# Altium schematic sheet CompensationRegression.SchDoc (part 2 of 2)
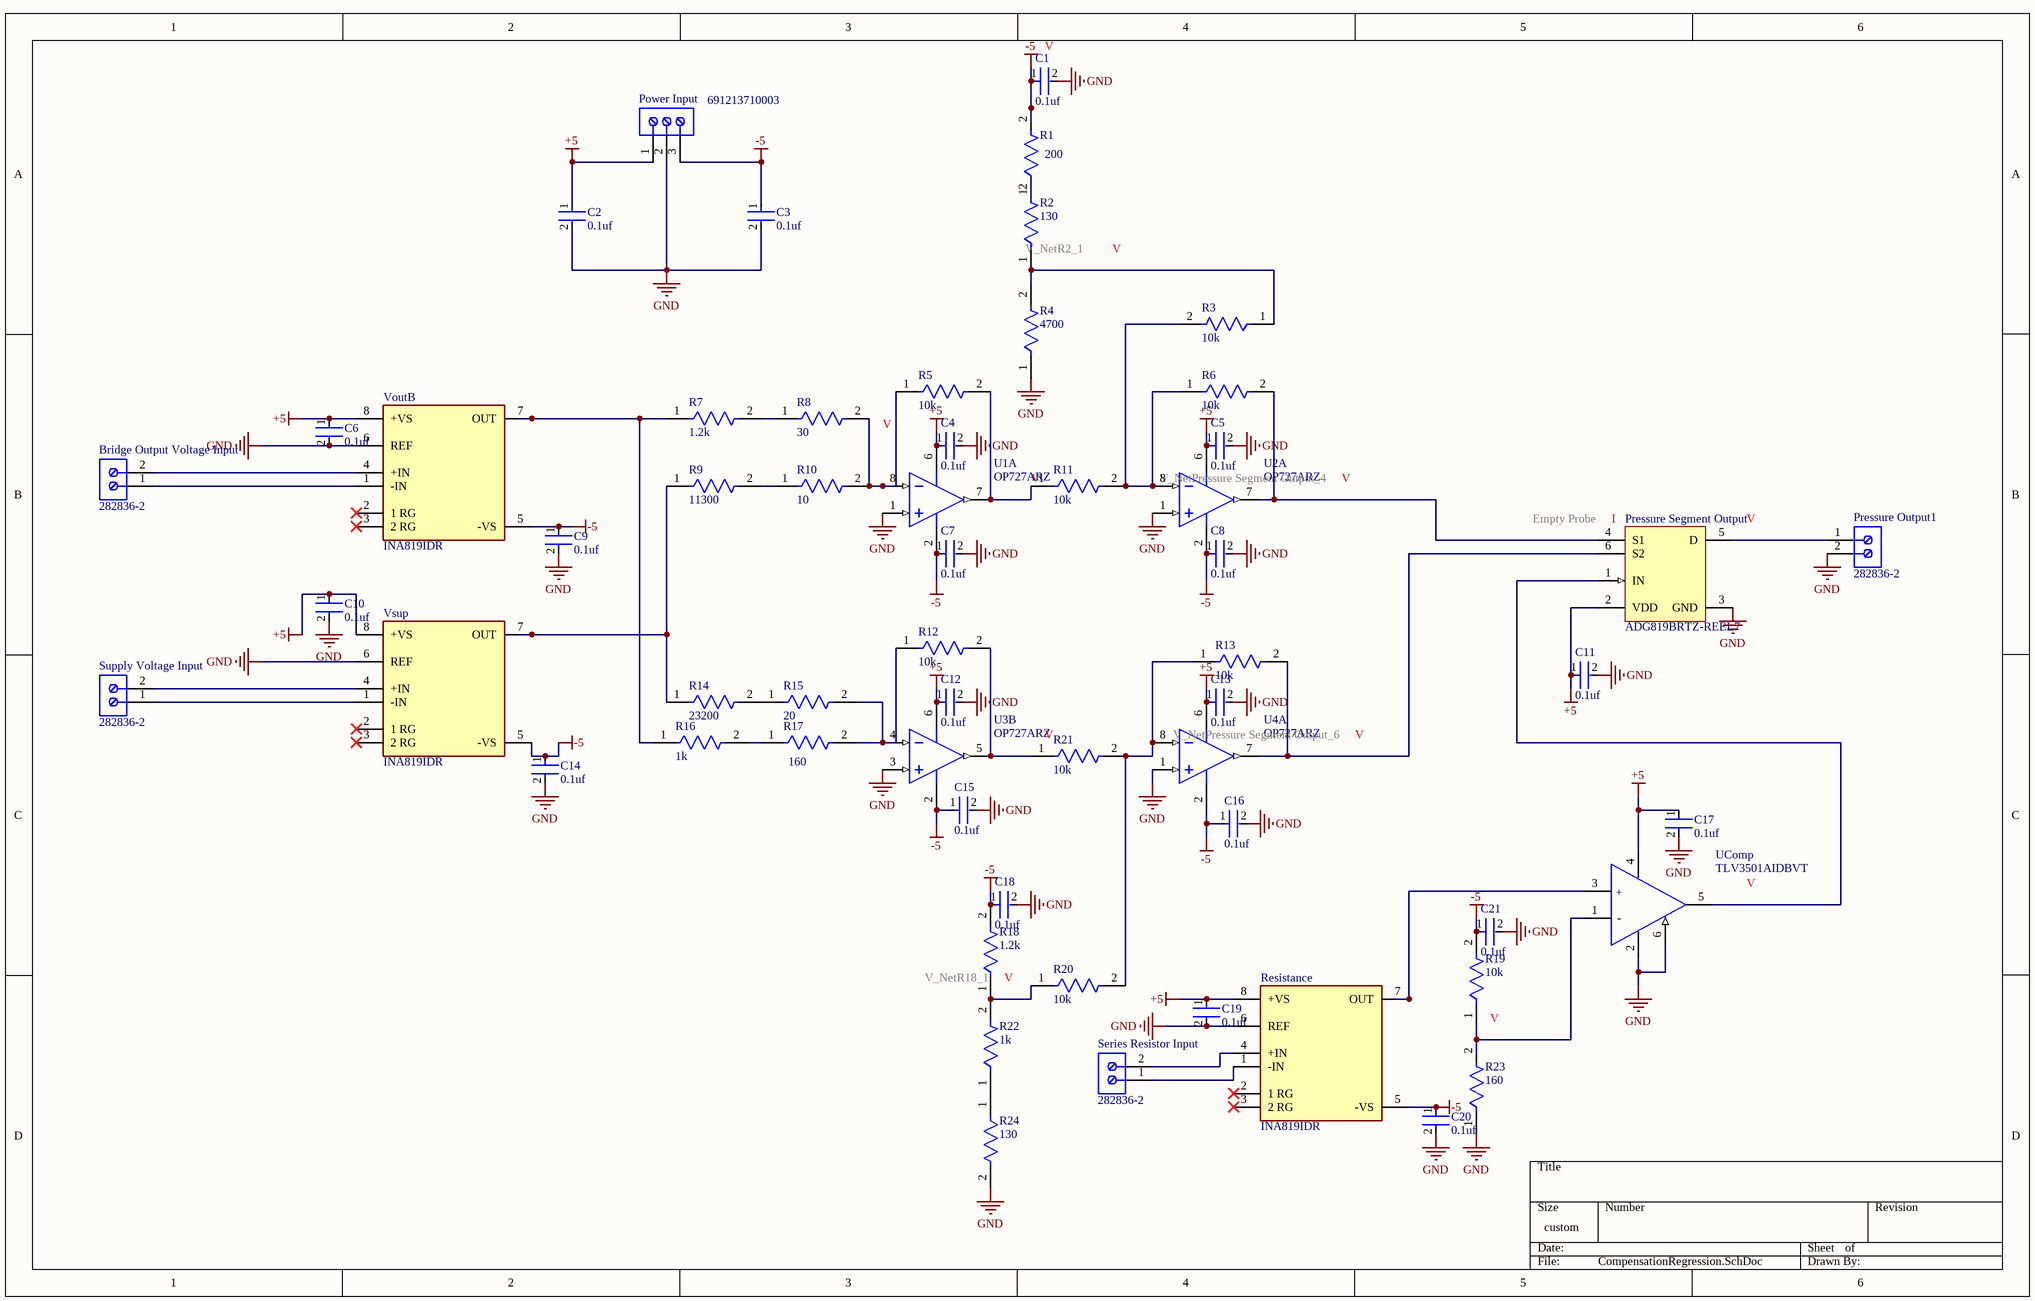
[diagram p1: CompensationRegression.SchDoc]

## Notes on the sheet
- (in symbol CMP-04896-000031-1) +; -

## Library data of the parts
Bridge_Output_Voltage_Input Pressure_Output1 Series_Resistor_Input Supply_Voltage_Input = CMP-1684-00017-1: Female Header, Pitch 5 mm, 1 x 2 Position, Height 10 mm, Tail Length 3.5 mm, Rohs, Bulk; Manufacturer: TE Connectivity; Wire Gauge: 16-30AWG; Product Training Modules: Wire-to-BoardEurostyleTerminalBlocks; Clamp Material - Plating: Brass-NickelPlated; Voltage: 300V; Mating Orientation: HorizontalwithBoard; Current: 13.5A; Pitch: 0.197"(5.00mm); Screw Thread: M3; 3D Model: 282836-2.pdf; Other Names: 5ULV-02B / A98076; Dynamic Catalog: BuchananSeries; Number of Levels: 1; Torque - Screw: 0.68Nm(6Lb-In); Featured Product: EurostyleTerminalBlockConnectors; Positions Per Level: 2; Wire Termination: Screw-RisingCageClamp; Datasheet URL: http://www.te.com.cn/commerce/DocumentDelivery/DDEController?Action=showdoc&DocId=Catalog+Section%7F1308389_EUROSTYLE_TERMINAL_BLOCKS%7F0607%7Fpdf%7FEnglish%7FENG_CS_1308389_EUROSTYLE_TERMINAL_BLOCKS_0607.pdf%7F282836-2; Color: Green; Family: TerminalBlocks-WiretoBoard; RoHS Information: 282836-2StatementofCompliance; Standard Package: 300; Contact Material - Plating: Brass-TinPlated; Manufacturer URL: http://www.te.com; Housing Material: Polyamide(PA66),Nylon6/6; Features: Interlocking(Side); Package Description: Female Header, Pitch 5 mm, 1 x 2 Position, Height 10 mm, Tail Length 3.5 mm; Mounting Type: ThroughHole; Package Reference: THD; Packaging: Bulk; Series: Buchanan; Category: Connectors,Interconnects; Screw Material - Plating: Brass-NickelPlated
C1-C21 = CMP-2006-03061-2: CAP CER 0.1UF 50V X7R 0603; Manufacturer: KEMET; Manufacturer Part Number: C0603C104K5RACTU; Tolerance: 0.1; Temperature Coefficient: 30ppm/°C; Material: Ceramic; Automotive Grade: Grade 1; Value: 0.10 μF; Temperature: -55°C to +125°C; RoHS: TRUE; Temperature Range High: +125°C; Lead Free: Yes; Octopart: https://octopart.com/c0603c104k5ractu-kemet-139244; Digikey Description: CAP CER 0.1UF 50V X7R 0603; Category: Cap; Package: C0603C-CF; ComponentLink2Description: Datasheet; Temperature Range Low: -55°C; Device Class L1: Passive Components; Voltage Rating: 50 V; Automotive: Yes; Device Class L3: Ceramic Capacitors; ComponentLink2URL: https://api.kemet.com/component-edge/download/datasheet/C0603C100J5GACAUTO.pdf; Capacitance: 0.10 μF; Device Class L2: Capacitors; Temperature Characteristic: X7R; Height: 0.87mm
Power_Input = CMP-1502-02527-2: NexarPartId: 8917719; Number of Contacts: 3; Wire/Cable Gauge: 16AWG; Wire Gauge (Max): 26AWG; Connector Type: PCB, Terminal Block; Number of Levels: 1; Plating: Brass, Steel; Current: 10A; Voltage: 300V; Stripping Length: -7mm; Pitch: 5.0038mm; REACH SVHC: Unknown; Mount: Through Hole; Max Operating Temperature: 105°C; Contact Plating: Tin; Termination: Screw; Contact Material: Brass; Housing Material: Nylon; Color: Green; RoHS: Compliant; Wire Gauge (Min): 16AWG; Min Operating Temperature: -40°C; Length: 8.3mm; Packaging: Box; Number of Pins: 3; Lead Pitch: 5mm; Number of Positions Per Level: 3; Height: 10mm; Width: 15.6mm
Pressure_Segment_Output = CMP-0790-00095-1: 0.5 Ohm, CMOS, 1.8 to 5.5 V, 2:1 Mux / SPDT Switch, -40 to 125 degC, 6-pin SOT23 (RJ-6), Reel; Manufacturer: Analog Devices; Ron (ohms): 0.5; Min Pos Supply: 1.8V; Id, Is (ON): 10pA, 10pA; Power Dissipation: 5uW; # Sw Functions: 1; Max Pos Supply: 5.5V; PackageDescription: 6-Pin Small Outline Transistor Package, Body 2.9 x 1.6 mm, Pitch 0.95 mm; PackageReference: RJ-6; PackageVersion: 121608-A, 12/2008; ComponentLink2Description: Datasheet; DatasheetVersion: 02-03-2012-A; Code_JEDEC: MO-178-AB; ComponentLink1Description: Manufacturer URL; ComponentLink3Description: Package Specification; Configuration: SPDT; ComponentLink2URL: http://www.analog.com/static/imported-files/data_sheets/ADG819.pdf; Is OFF: 10pA, 10pA; Mounting Technology: Surface Mount; Packing: Reel; PartNumber: ADG819BRTZ-REEL7; ComponentLink3URL: http://www.analog.com/static/imported-files/packages/PKG_PDF/SOT-23(RJ)/RJ_6.pdf; ComponentLink1URL: http://www.analog.com/en/index.html
R1 = CMP-2000-03062-2: RES Thick Film, 200Ω, 1%, 0.1W, 100ppm/°C, 0603; Power Rating: 100mW; Voltage Rating (DC): 75V; Resistance: 200R; Value: 200R; Military Standard: Not; Tolerance: 1%; Lead Free: Lead Free; Case Code (Imperial): 0603; Depth: 0.85mm; Max Operating Temperature: 155°C; Contact Plating: Tin; Length: 1.55mm; Weight: 7.1E-05oz; Voltage Rating: 75V; Height: 0.45mm; Min Operating Temperature: -55°C; Case/Package: 0603; Number of Pins: 2; Composition: Thick Film; Termination: SMD/SMT; Case Code (Metric): 1608; Width: 0.85mm; Package Quantity: 5000; Temperature Coefficient: 100ppm/°C; Packaging: Tape and Reel
R2 R24 = CMP-2000-03889-2: RES Thick Film, 130Ω, 1%, 0.1W, 100ppm/°C, 0603; Working Voltage: 75V; Power Rating: 100mW; Resistance: 130R; Value: 130R; Depth: 0.85mm; Max Operating Temperature: 155°C; Width: 0.85mm; Composition: Thick Film; Radiation Hardening: No; Contact Plating: Tin; Tolerance: 1%; Number of Pins: 2; Length: 1.55mm; Case/Package: 0603; Features: Automotive AEC-Q200; Case Code (Metric): 1608; Min Operating Temperature: -55°C; Package Quantity: 10; Temperature Coefficient: 100ppm/°C; Packaging: Tape and Reel; Lead Free: Lead Free; Number of Terminations: 2; Voltage Rating (DC): 75V; Termination: SMD/SMT; Height: 0.45mm; Military Standard: Not; Max Power Dissipation: 100mW; Voltage Rating: 75V; Weight: 7.1E-05oz; Case Code (Imperial): 0603
R3 R5 R6 R11-R13 R19-R21 = CMP-03412-005349-1: RES SMD 10K OHM 1% 1/10W 0603; Manufacturer: Yageo; Manufacturer Part Number: RT0603FRE0710KL; Value: 10KΩ; Temperature Coefficient: 50 ppm/°C; Power Rating: 0.1W; Tolerance: 0.01; Voltage Rating: 75V; RoHS: TRUE; Category: Res; Automotive: No; Digikey Description: RES SMD 10K OHM 1% 1/10W 0603; ComponentLink2Description: Datasheet; Octopart: https://octopart.com/rt0603fre0710kl-yageo-40009243; ComponentLink2URL: http://www.yageo.com/documents/recent/PYu-RT_1-to-0.01_RoHS_L_9.pdf; Device Class L3: Chip SMD Resistors; Device Class L1: Passive Components; Temperature Range High: +155°C; Height: 0.55mm; Composition: Thin Film; Ipc Land Pattern Name: RESC16080X45; Series: RT; Package: RT0603; Resistance: 10KΩ; Footprint Url: http://www.yageo.com/exep/pages/download/literatures/PYu-R_Mount_10.pdf; Temperature: -55°C to +155°C; Temperature Range Low: -55°C; Lead Free: Yes; Device Class L2: Resistors; Mouser Description: Thin Film Resistors - SMD 10K ohm 1% 1/10W
R4 = CMP-02407-006571-1: RES SMD 100 OHM 1% 1/8W 0603; Tolerance: 0.1%; Temperature Coefficient: 25ppm/°C; Power Rating: 100mW; Resistance: 4.7kR; Max Operating Temperature: 125°C; Lead Free: Lead Free; Contact Plating: Tin; Depth: 0.85mm; Case/Package: 0603; Packaging: Tape and Reel; Min Operating Temperature: -55°C; Composition: Thin Film; Military Standard: Not; Mount: Surface Mount; Width: 850um; Radiation Hardening: No; Length: 1.55mm; Height: 0.45mm
R7 = CMP-28537-003800-1: Automotive Metal Thin Film Chip Resistor, 0402, 1.2kΩ, 0.05%, 25ppm/°C, 0.0625W, 75V / Actually TNPW04021K20BYEP; Voltage Rating: 25V; Power Rating: 30mW; Resistance: 1.2kR; Max Power Dissipation: 63mW; Value: 1.2kR; Case Code (Imperial): 0402; Termination: SMD/SMT; Lead Free: Lead Free; Packaging: Tape and Reel; Case Code (Metric): 1005; Series: RG; Min Operating Temperature: -55°C; Temperature Coefficient: 25ppm/°C; Length: 1mm; Tolerance: 0.05%; Width: 0.5mm; RoHS Compliant: Yes; Number of Terminations: 2; Voltage Rating (DC): 25V; Resistor Type: Thin Film; Package Quantity: 5000; Case/Package: 0402; Height: 0.35mm; Features: Automotive AEC-Q200; Max Operating Temperature: 155°C
R8 = CMP-2001-03810-2: RES SMD 30 OHM 1% 1/8W 0805; Manufacturer Part Number: CRCW080530R0FKEA; Manufacturer: Vishay; Temperature Coefficient: 100ppm/°C; Voltage Rating: 150V; Automotive Grade: Grade 0; Resistance: 30Ω; Power Rating: 0.125W; Value: 30Ω; Category: Res; Octopart: https://octopart.com/crcw080530r0fkea-vishay-39861726; Height: 0.5mm; Automotive: Yes; Mouser Description: Thick Film Resistors - SMD 1/8watt 30ohms 1%; Series: CRCW; Temperature Range Low: -55°C; Device Class L1: Passive Components; Device Class L2: Resistors; Lead Free: Yes; Package: CRCW0805-e3; Tolerance: 1%; Ipc Land Pattern Name: RESC200125X45; Temperature: -55°C to +155°C; RoHS: TRUE; Temperature Range High: +155°C; Device Class L3: Chip SMD Resistors; ComponentLink2Description: Datasheet; Composition: Thick Film; ComponentLink2URL: https://www.vishay.com/docs/20035/dcrcwe3.pdf; Digikey Description: RES SMD 30 OHM 1% 1/8W 0805
R9 = CMP-03211-001549-1: RP73P 0402 11.3Ω 0.1W 25ppm/°C 0.10% 50V; Manufacturer: TE Connectivity; Manufacturer Part Number: RP73PF1E11R3BTDF; Temperature: -55°C to +155°C; Package: RP73P-1E; Power Rating: 0.1W; Ipc Land Pattern Name: RESC10050X30; Resistance: 11.3Ω; Device Class L2: Resistors; RoHS: TRUE; Value: 11.3Ω; Device Class L1: Passive Components; Temperature Range Low: -55°C; Category: Res; ComponentLink2URL: https://www.te.com/commerce/DocumentDelivery/DDEController?Action=srchrtrv&DocNm=1773272&DocType=DS&DocLang=English; Device Class L3: Chip SMD Resistors; Series: RP73P; ComponentLink2Description: Datasheet; Octopart: https://octopart.com/rp73pf1e11r3btdf-te+connectivity-89154032; Temperature Range High: +155°C; Automotive: No; Composition: Thin Film; Temperature Coefficient: 25ppm/°C; Tolerance: 0.10%; Lead Free: Yes; Voltage Rating: 50V; Height: 0.35mm
R10 = CMP-2000-03845-2: RES Thick Film, 10Ω, 1%, 0.1W, 100ppm/°C, 0603; Resistance: 10R; Voltage Rating (DC): 75V; Power Rating: 100mW; Value: 10R; Depth: 0.85mm; Height: 0.45mm; Package Quantity: 10; Temperature Coefficient: 100ppm/°C; Weight: 7.1E-05oz; Case Code (Metric): 1608; Number of Terminations: 2; Features: Automotive AEC-Q200; Termination: SMD/SMT; Lead Free: Lead Free; Mount: Surface Mount; Number of Pins: 2; Tolerance: 1%; Max Power Dissipation: 100mW; Width: 0.033inch; Contact Plating: Tin; Case Code (Imperial): 0603; Max Operating Temperature: 155°C; Min Operating Temperature: -55°C; Voltage Rating: 75V; Length: 1.55mm; Case/Package: 0603; Composition: Thick Film; Packaging: Tape and Reel; Military Standard: Not
R14 = CMP-2000-03845-2: RES Thick Film, 10Ω, 1%, 0.1W, 100ppm/°C, 0603 / Should be RMCF0603FT23K2; Resistance: 10R; Voltage Rating (DC): 75V; Power Rating: 100mW; Value: 10R; Depth: 0.85mm; Height: 0.45mm; Package Quantity: 10; Temperature Coefficient: 100ppm/°C; Weight: 7.1E-05oz; Case Code (Metric): 1608; Number of Terminations: 2; Features: Automotive AEC-Q200; Termination: SMD/SMT; Lead Free: Lead Free; Mount: Surface Mount; Number of Pins: 2; Tolerance: 1%; Max Power Dissipation: 100mW; Width: 0.033inch; Contact Plating: Tin; Case Code (Imperial): 0603; Max Operating Temperature: 155°C; Min Operating Temperature: -55°C; Voltage Rating: 75V; Length: 1.55mm; Case/Package: 0603; Composition: Thick Film; Packaging: Tape and Reel; Military Standard: Not
R15 = CMP-2002-08359-2: RES Thick Film, 20Ω, 1%, 0.063W, 100ppm/°C, 0402; Resistance: 20R; Voltage Rating: 50V; Max Power Dissipation: 63mW; Value: 20R; Mount: Surface Mount; Packaging: Tape and Reel; Military Standard: Not; Height: 0.35mm; Depth: 0.5mm; Lead Free: Lead Free; Number of Terminations: 2; Contact Plating: Tin; Max Operating Temperature: 155°C; Package Quantity: 10; Termination: SMD/SMT; Min Operating Temperature: -55°C; Features: Automotive AEC-Q200; Radiation Hardening: No; Case Code (Metric): 1005; Width: 0.02inch; Composition: Thick Film; Case/Package: 0402; Case Code (Imperial): 0402; Temperature Coefficient: 100ppm/°C; Tolerance: 1%; Power Rating: 63mW; Voltage Rating (DC): 50V; Length: 1mm; Weight: 2.3E-05oz
R16 R22 = CMP-2002-08276-2: RES Thick Film, 1kΩ, 1%, 0.063W, 100ppm/°C, 0402; Resistance: 1kR; Power Rating: 63mW; Voltage Rating (DC): 50V; Value: 1kR; Package Quantity: 10; Termination: SMD/SMT; Width: 0.5mm; Military Standard: Not; Length: 1mm; Contact Plating: Tin; Mount: Surface Mount; Packaging: Tape and Reel; Case Code (Imperial): 0402; Tolerance: 1%; Weight: 2.3E-05oz; Number of Pins: 2; Case/Package: 0402; Case Code (Metric): 1005; Lead Free: Lead Free; Number of Terminations: 2; Max Power Dissipation: 63mW; Depth: 0.5mm; Temperature Coefficient: 100ppm/°C; Max Operating Temperature: 155°C; Height: 0.35mm; Features: Automotive AEC-Q200; Composition: Thick Film; Radiation Hardening: No; Voltage Rating: 50V; Min Operating Temperature: -55°C
R17 R23 = CMP-2002-08228-2: RES Thick Film, 160Ω, 1%, 0.063W, 100ppm/°C, 0402; Power Rating: 63mW; Voltage Rating: 50V; Resistance: 160R; Value: 160R; Min Operating Temperature: -55°C; Composition: Thick Film; Depth: 0.5mm; Temperature Coefficient: 100ppm/°C; Military Standard: Not; Case/Package: 0402; Radiation Hardening: No; Max Operating Temperature: 155°C; Case Code (Metric): 1005; Number of Terminations: 2; Weight: 2.3E-05oz; Tolerance: 1%; Features: Automotive AEC-Q200; Width: 0.02inch; Number of Pins: 2; Length: 1mm; Max Power Dissipation: 63mW; Case Code (Imperial): 0402; Height: 0.016inch; Termination: SMD/SMT; Package Quantity: 10; Packaging: Tape and Reel; Contact Plating: Tin
R18 = CMP-28537-003800-1: Automotive Metal Thin Film Chip Resistor, 0402, 1.2kΩ, 0.05%, 25ppm/°C, 0.0625W, 75V; Voltage Rating: 25V; Power Rating: 30mW; Resistance: 1.2kR; Max Power Dissipation: 63mW; Value: 1.2kR; Case Code (Imperial): 0402; Termination: SMD/SMT; Lead Free: Lead Free; Packaging: Tape and Reel; Case Code (Metric): 1005; Series: RG; Min Operating Temperature: -55°C; Temperature Coefficient: 25ppm/°C; Length: 1mm; Tolerance: 0.05%; Width: 0.5mm; RoHS Compliant: Yes; Number of Terminations: 2; Voltage Rating (DC): 25V; Resistor Type: Thin Film; Package Quantity: 5000; Case/Package: 0402; Height: 0.35mm; Features: Automotive AEC-Q200; Max Operating Temperature: 155°C
Resistance VoutB Vsup = CMP-04895-000469-1: IC INST AMP 1 CIRCUIT 8SOIC
U1-U4 = CMP-0384-00649-1: Double Channel Rail-to-Rail Operational Amplifier, 700 KHz BW, 200 mV/us SR, Industrial, 8-pin SOIC (R-8), Tube; Generic Part Number: OP727; Manufacturer: Analog Devices; V Span Max: 36V; V Span Min: 3V; Input Offset Voltage: 30uV; Iq/Amp: 290uA; Input Bias Current: 5.5nA; Small Signal Bandwidth: 700KHz; Amplifiers Per Package: 2; ComponentLink1URL: http://www.analog.com/en/index.html; ComponentLink2Description: Datasheet; ComponentLink1Description: Manufacturer URL; Mounting Technology: Surface Mount; PackageVersion: 060506-A; ComponentLink3URL: http://www.analog.com/static/imported-files/packages/PKG_PDF/SOIC_Narrow%20(R)/R_8.pdf; PackageReference: R-8; Code_JEDEC: MS-012-AA; DatasheetVersion: Rev. D; ComponentLink3Description: Package Specification; PartNumber: OP727ARZ; ComponentLink2URL: http://www.analog.com/static/imported-files/data_sheets/OP777_727_747.pdf; PackageDescription: 8-Pin Standard Small Outline Package, Body 3.9 x 4.9 mm, Pitch 1.27 mm; Slew Rate: 200mV/us
UComp = CMP-04896-000031-1: IC COMP 4.5NS R-R HS SOT23-6; Manufacturer: Texas Instruments; Input Bias Current: 0.000002uA; Input Offset Voltage: 1mV; Number Of Channels: 1; Max Junction Temp: +150°C; Standoff Height: 0mm; Output Current Per Channel: 74mA; Min Supply Voltage: 2.2V; Min Dual Supply Voltage: 1.35V; Max Supply Voltage: 5.5V; Max Dual Supply Voltage: 2.75V; Nominal Supply Current: 3.2mA; Temperature: -40°C to +125°C; Manufacturer Part Number: TLV3501AIDBVT; ComponentLink2URL: https://www.ti.com/lit/ds/symlink/tlv3501.pdf; Ambient Temperature Range Low: -40°C; ComponentLink2Description: Datasheet; Package: DBV0006A; Temperature Range High: +125°C; Mouser Description: Analog Comparators 4.5ns Rail-to-Rail High Speed; RoHS: TRUE; Ambient Temperature Range High: +125°C; Device Class L1: Integrated Circuits (ICs); Device Class L2: Linear ICs; Automotive: No; Height: 1.45mm; Octopart: https://octopart.com/tlv3501aidbvt-texas+instruments-428399; Digikey Description: IC COMP 4.5NS R-R HS SOT23-6; Category: IC; Lead Free: Yes; Device Class L3: Comparators; Temperature Range Low: -40°C